# EAGLE design main3 (EAGLE 9.0.1)
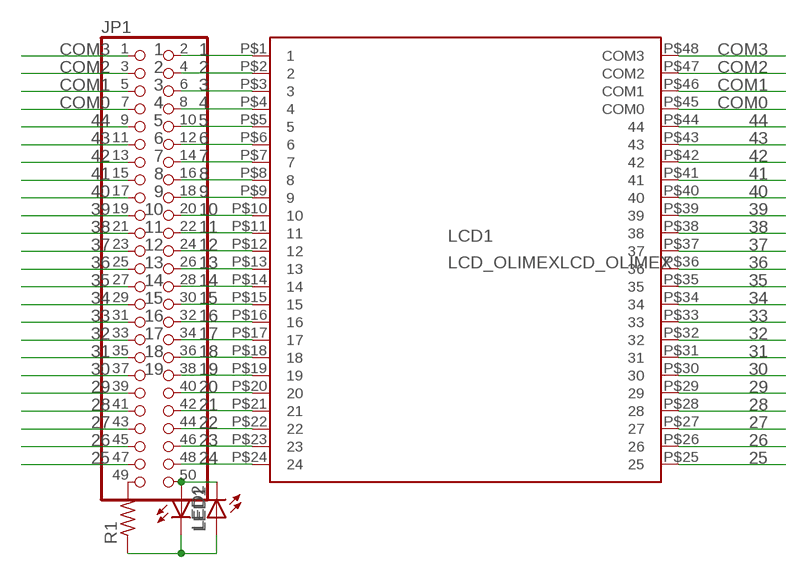
[diagram p0: schematic, sheet 1]

## Parts
JP1  PINHD-2X25  [2X25]
LCD1  LCD_OLIMEXLCD_OLIMEX  [LCD_OLIMEX]
LED1  LED_ESML0603  [LED_SML0603]
LED2  LED_ESML0603  [LED_SML0603]
R1  R-US_R0603  [R0603]

## Nets
1: JP1.2 LCD1.P$1
2: JP1.4 LCD1.P$2
3: JP1.6 LCD1.P$3
4: JP1.8 LCD1.P$4
5: JP1.10 LCD1.P$5
6: JP1.12 LCD1.P$6
7: JP1.14 LCD1.P$7
8: JP1.16 LCD1.P$8
9: JP1.18 LCD1.P$9
10: JP1.20 LCD1.P$10
11: JP1.22 LCD1.P$11
12: JP1.24 LCD1.P$12
13: JP1.26 LCD1.P$13
14: JP1.28 LCD1.P$14
15: JP1.30 LCD1.P$15
16: JP1.32 LCD1.P$16
17: JP1.34 LCD1.P$17
18: JP1.36 LCD1.P$18
19: JP1.38 LCD1.P$19
20: JP1.40 LCD1.P$20
21: JP1.42 LCD1.P$21
22: JP1.44 LCD1.P$22
23: JP1.46 LCD1.P$23
24: JP1.48 LCD1.P$24
25: JP1.47 LCD1.P$25
26: JP1.45 LCD1.P$26
27: JP1.43 LCD1.P$27
28: JP1.41 LCD1.P$28
29: JP1.39 LCD1.P$29
30: JP1.37 LCD1.P$30
31: JP1.35 LCD1.P$31
32: JP1.33 LCD1.P$32
33: JP1.31 LCD1.P$33
34: JP1.29 LCD1.P$34
35: JP1.27 LCD1.P$35
36: JP1.25 LCD1.P$36
37: JP1.23 LCD1.P$37
38: JP1.21 LCD1.P$38
39: JP1.19 LCD1.P$39
40: JP1.17 LCD1.P$40
41: JP1.15 LCD1.P$41
42: JP1.13 LCD1.P$42
43: JP1.11 LCD1.P$43
44: JP1.9 LCD1.P$44
COM0: JP1.7 LCD1.P$45(COM0)
COM1: JP1.5 LCD1.P$46(COM1)
COM2: JP1.3 LCD1.P$47(COM2)
COM3: JP1.1 LCD1.P$48(COM3)
N$1: JP1.50 LED1.A LED2.C
N$2: JP1.49 R1.2
N$3: LED1.C LED2.A R1.1

## Library data of the parts
JP1 = pinhead:PINHD-2X25: PIN HEADER
LCD1 = 7_segment_lib:LCD_OLIMEX: Untitled 1 edit this description Auto generated by make-symbol-device-package-bsdl.ulp Rev. 44 Source: Untitled 1.txt
LED1 LED2 = eagle-ltspice:LED_E: LED Source: http://www.osram.convergy.de Source: www.luxeon.com Source: www.kingbright.com; SPICEMODEL: NONE; SPICEPREFIX: D; SPICETYPE: diode
R1 = rcl:R-US_: RESISTOR, American symbol; SPICEPREFIX: R

## Board
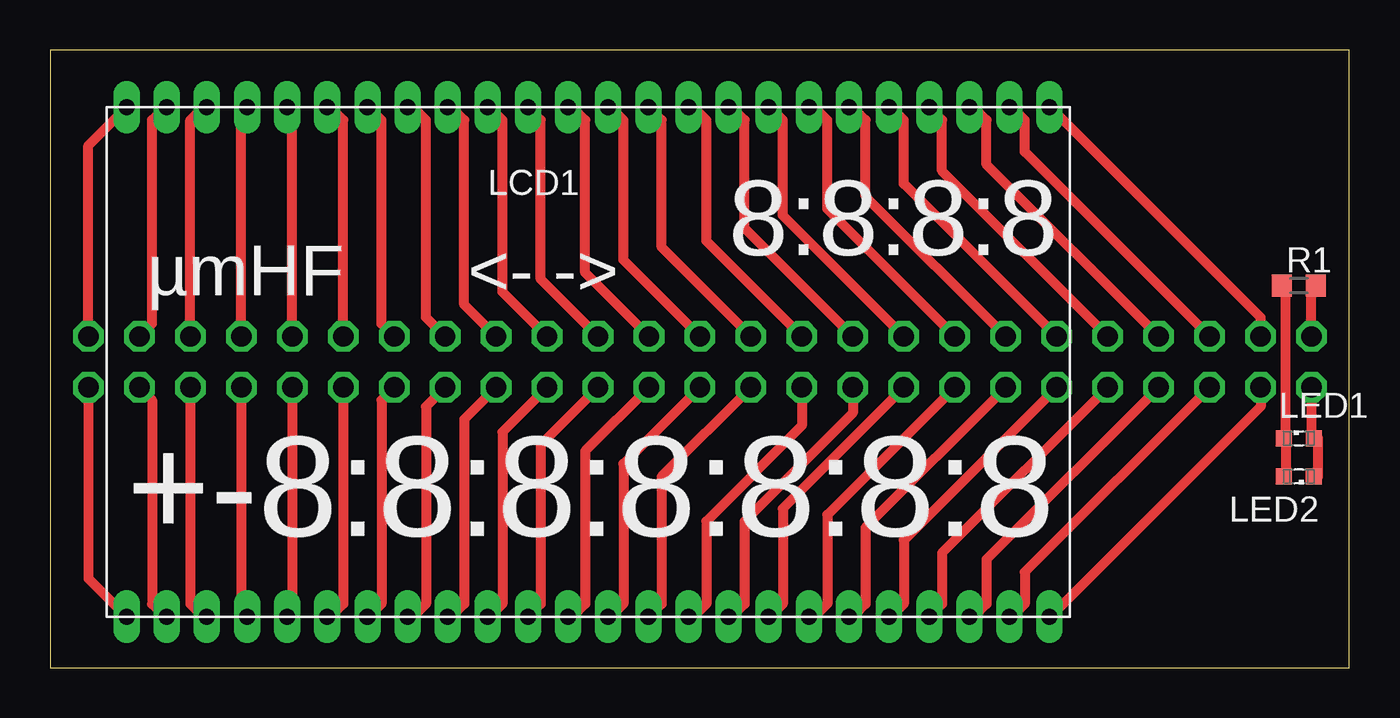
[diagram p1: board, top side]
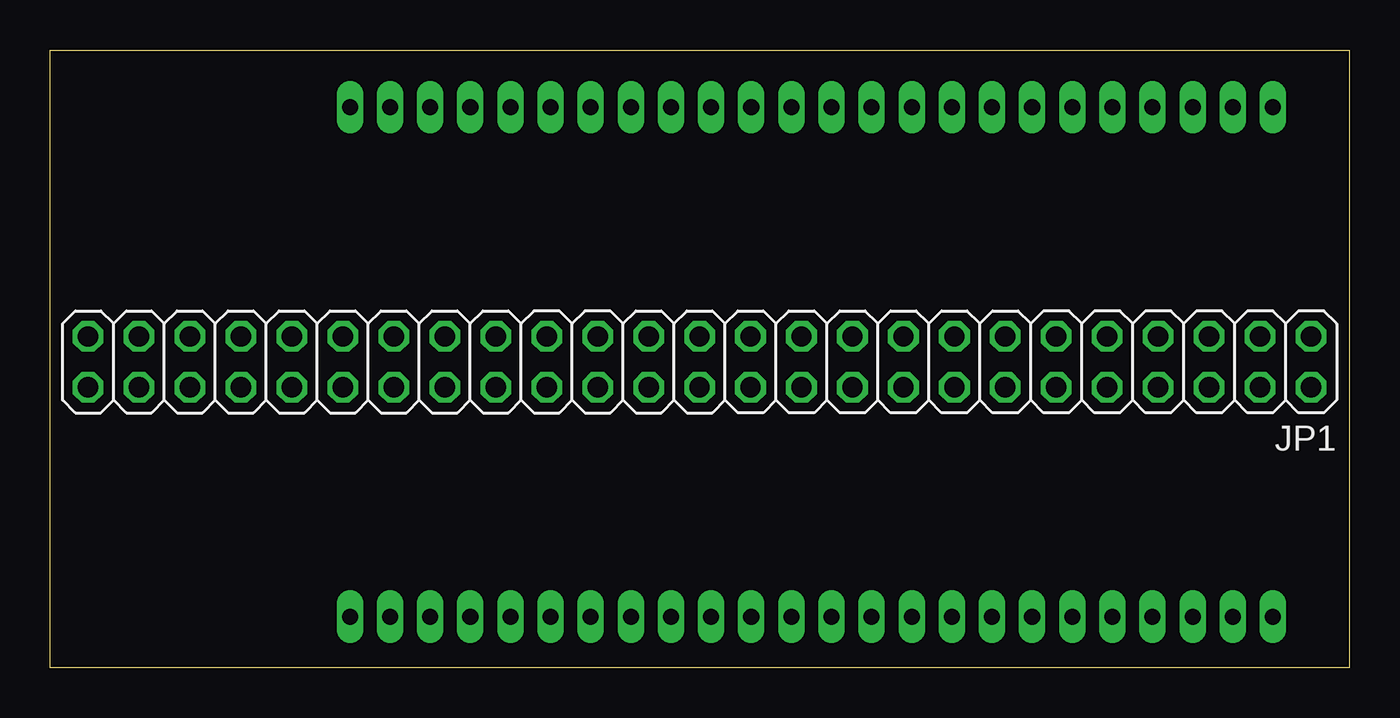
[diagram p2: board, bottom side, seen from below]

Size 64.75 x 30.79 mm. Coordinates in mm from the lower left corner, seen from the top.
Outline: 0,0 64.75,0 64.75,30.79 0,30.79 0,0
Copper layers (1*16): Top 0.035mm / dielectric 1.5mm / Bottom 0.035mm
Design rules "default *": minimum track width 20mil, minimum drill 0.35mm, track to track 6mil, track to pad 6mil, pad to pad 6mil, via to via 6mil, smd to smd 6mil, copper to edge 40mil, drill to drill 6mil, minimum pad ring 10mil, minimum via ring 8mil, stop-mask expansion 4mil, vias tented up to drill 0mil, thermal gap 10mil

### Footprints (pad centres in the part's own frame; a part is rotated, then mirrored left to right if it is on the bottom)
2X25 = drill 1.016 octagon: 1 -30.48,-1.27; 2 -30.48,1.27; 3 -27.94,-1.27; 4 -27.94,1.27; 5 -25.4,-1.27; 6 -25.4,1.27; 7 -22.86,-1.27; 8 -22.86,1.27; 9 -20.32,-1.27; 10 -20.32,1.27; 11 -17.78,-1.27; 12 -17.78,1.27; 13 -15.24,-1.27; 14 -15.24,1.27; 15 -12.7,-1.27; 16 -12.7,1.27; 17 -10.16,-1.27; 18 -10.16,1.27; 19 -7.62,-1.27; 20 -7.62,1.27; 21 -5.08,-1.27; 22 -5.08,1.27; 23 -2.54,-1.27; 24 -2.54,1.27; 25 0,-1.27; 26 0,1.27; 27 2.54,-1.27; 28 2.54,1.27; 29 5.08,-1.27; 30 5.08,1.27; 31 7.62,-1.27; 32 7.62,1.27; 33 10.16,-1.27; 34 10.16,1.27; 35 12.7,-1.27; 36 12.7,1.27; 37 15.24,-1.27; 38 15.24,1.27; 39 17.78,-1.27; 40 17.78,1.27; 41 20.32,-1.27; 42 20.32,1.27; 43 22.86,-1.27; 44 22.86,1.27; 45 25.4,-1.27; 46 25.4,1.27; 47 27.94,-1.27; 48 27.94,1.27; 49 30.48,-1.27; 50 30.48,1.27
LCD_OLIMEX = drill 0.8 long: P$1 0,0; P$2 2,0; P$3 4,0; P$4 6,0; P$5 8,0; P$6 10,0; P$7 12,0; P$8 14,0; P$9 16,0; P$10 18,0; P$11 20,0; P$12 22,0; P$13 24,0; P$14 26,0; P$15 28,0; P$16 30,0; P$17 32,0; P$18 34,0; P$19 36,0; P$20 38,0; P$21 40,0; P$22 42,0; P$23 44,0; P$24 46,0; P$25 46,25.4; P$26 44,25.4; P$27 42,25.4; P$28 40,25.4; P$29 38,25.4; P$30 36,25.4; P$31 34,25.4; P$32 32,25.4; P$33 30,25.4; P$34 28,25.4; P$35 26,25.4; P$36 24,25.4; P$37 22,25.4; P$38 20,25.4; P$39 18,25.4; P$40 16,25.4; P$41 14,25.4; P$42 12,25.4; P$43 10,25.4; P$44 8,25.4; P$45 6,25.4; P$46 4,25.4; P$47 2,25.4; P$48 0,25.4
LED_SML0603 = smd 0.8 x 0.8: A 0.75,0; C -0.75,0
R0603 = smd 1 x 1.1: 1 -0.85,0; 2 0.85,0

### Placement (x,y rotation side)
JP1  32.38,15.24 180 bottom
LCD1  3.81,2.54 0 top
LED1  62.23,11.43 0 top
LED2  62.23,9.52 180 top
R1  62.23,19.05 0 top

### Tracks (layer width: path | path; a pad name or v marks a point on that pad's centre or on a via)
1
  Top 0.508: LCD1.P$1 1.91,4.45 JP1.2
2
  Top 0.508: JP1.4 5.08,13.34 5.08,3.17 5.72,2.54 LCD1.P$2
3
  Top 0.508: JP1.6 6.98,3.17 7.62,2.54 LCD1.P$3
4
  Top 0.508: JP1.8 9.52,2.54 LCD1.P$4
5
  Top 0.508: JP1.10 12.07,2.54 LCD1.P$5
6
  Top 0.508: JP1.12 14.61,3.17 13.97,2.54 LCD1.P$6
7
  Top 0.508: JP1.14 16.51,13.34 16.51,3.17 15.88,2.54 LCD1.P$7
8
  Top 0.508: JP1.16 18.73,13.02 18.73,3.17 18.1,2.54 LCD1.P$8
9
  Top 0.508: JP1.18 20.64,12.38 20.64,3.17 20,2.54 LCD1.P$9
10
  Top 0.508: JP1.20 22.54,11.75 22.54,3.17 21.91,2.54 LCD1.P$10
11
  Top 0.508: JP1.22 24.45,11.11 24.45,3.17 LCD1.P$11
12
  Top 0.508: JP1.24 26.67,10.79 26.67,3.17 26.04,2.54 LCD1.P$12
13
  Top 0.508: JP1.26 28.57,10.16 28.57,3.17 27.94,2.54 LCD1.P$13
14
  Top 0.508: JP1.28 30.48,9.52 30.48,3.17 29.85,2.54 LCD1.P$14
15
  Top 0.508: JP1.30 37.46,12.06 32.7,7.3 32.7,3.17 32.07,2.54 LCD1.P$15
16
  Top 0.508: JP1.32 40.01,12.7 34.61,7.3 34.61,3.17 33.97,2.54 LCD1.P$16
17
  Top 0.508: JP1.34 36.51,7.94 36.51,3.17 35.88,2.54 LCD1.P$17
18
  Top 0.508: JP1.36 38.74,7.62 38.74,3.17 38.1,2.54 LCD1.P$18
19
  Top 0.508: JP1.38 40.64,6.98 40.64,3.17 40.01,2.54 LCD1.P$19
20
  Top 0.508: JP1.40 42.54,6.35 42.54,3.17 41.91,2.54 LCD1.P$20
21
  Top 0.508: JP1.42 44.45,5.71 44.45,3.17 LCD1.P$21
22
  Top 0.508: JP1.44 46.67,5.4 46.67,3.17 46.04,2.54 LCD1.P$22
23
  Top 0.508: JP1.46 48.58,4.76 48.58,3.17 47.94,2.54 LCD1.P$23
24
  Top 0.508: JP1.48 60.32,13.02 49.85,2.54 LCD1.P$24
25
  Top 0.508: JP1.47 60.32,17.46 49.85,27.94 LCD1.P$25
26
  Top 0.508: JP1.45 48.58,25.72 48.58,27.3 47.94,27.94 LCD1.P$26
27
  Top 0.508: JP1.43 46.67,25.08 46.67,27.3 46.04,27.94 LCD1.P$27
28
  Top 0.508: JP1.41 44.45,24.76 44.45,27.3 LCD1.P$28
29
  Top 0.508: JP1.39 42.54,24.13 42.54,27.3 41.91,27.94 LCD1.P$29
30
  Top 0.508: JP1.37 40.64,23.49 40.64,27.3 40.01,27.94 LCD1.P$30
31
  Top 0.508: JP1.35 38.74,22.86 38.74,27.3 38.1,27.94 LCD1.P$31
32
  Top 0.508: JP1.33 36.51,22.54 36.51,27.3 35.88,27.94 LCD1.P$32
33
  Top 0.508: JP1.31 34.61,21.91 34.61,27.3 33.97,27.94 LCD1.P$33
34
  Top 0.508: JP1.29 32.7,21.27 32.7,27.3 32.07,27.94 LCD1.P$34
35
  Top 0.508: JP1.27 30.48,20.95 30.48,27.3 29.85,27.94 LCD1.P$35
36
  Top 0.508: JP1.25 28.57,20.32 28.57,27.3 27.94,27.94 LCD1.P$36
37
  Top 0.508: JP1.23 26.67,19.68 26.67,27.3 26.04,27.94 LCD1.P$37
38
  Top 0.508: JP1.21 24.45,19.37 24.45,27.3 LCD1.P$38
39
  Top 0.508: JP1.19 22.54,18.73 22.54,27.3 21.91,27.94 LCD1.P$39
40
  Top 0.508: JP1.17 20.64,18.1 20.64,27.3 20,27.94 LCD1.P$40
41
  Top 0.508: JP1.15 18.73,17.46 18.73,27.3 18.1,27.94 LCD1.P$41
42
  Top 0.508: JP1.13 16.51,17.15 16.51,27.3 15.88,27.94 LCD1.P$42
43
  Top 0.508: JP1.11 14.61,27.3 13.97,27.94 LCD1.P$43
44
  Top 0.508: JP1.9 12.07,27.94 LCD1.P$44
COM0
  Top 0.508: JP1.7 9.52,27.94 LCD1.P$45
COM1
  Top 0.508: JP1.5 6.98,27.3 7.62,27.94 LCD1.P$46
COM2
  Top 0.508: JP1.3 5.08,17.15 5.08,27.3 5.72,27.94 LCD1.P$47
COM3
  Top 0.508: LCD1.P$48 1.91,26.04 JP1.1
N$1
  Top 0.508: LED2.C 63.18,9.52 63.18,11.43 LED1.A 62.87,11.43 JP1.50
N$2
  Top 0.508: JP1.49 62.87,19.05 R1.2
N$3
  Top 0.508: 61.6,11.43 61.6,9.52 LED2.A | 61.6,11.43 61.6,19.05 R1.1 | 61.6,11.43 LED1.C